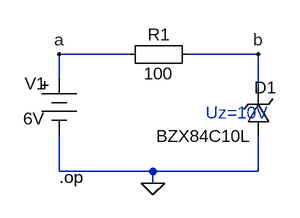
[diagram p0: schematic zener_current_1.asc]
zener_current_1.asc, the LTspice schematic file:
Version 4
SHEET 1 880 680
WIRE 112 -256 16 -256
WIRE 288 -256 192 -256
WIRE 16 -224 16 -256
WIRE 288 -208 288 -256
WIRE 16 -96 16 -144
WIRE 144 -96 16 -96
WIRE 288 -96 288 -144
WIRE 288 -96 144 -96
WIRE 144 -80 144 -96
FLAG 144 -80 0
FLAG 288 -256 b
FLAG 16 -256 a
SYMBOL Misc\\battery 16 -240 R0
WINDOW 123 0 0 Left 2
WINDOW 39 0 0 Left 2
WINDOW 0 -47 24 Left 2
WINDOW 3 -49 72 Left 2
SYMATTR InstName V1
SYMATTR Value 6V
SYMBOL Misc\\EuropeanResistor 208 -272 R90
WINDOW 0 5 56 VBottom 2
WINDOW 3 27 56 VTop 2
SYMATTR InstName R1
SYMATTR Value 100
SYMBOL zener 304 -144 R180
WINDOW 0 -9 66 Left 2
WINDOW 3 24 0 Left 2
SYMATTR InstName D1
SYMATTR Value BZX84C10L
TEXT 16 -88 Left 2 !.op
TEXT 216 -176 Left 2 ;Uz=10V

The netlist it stands for:
* zener_current_1.asc
V1 a 0 6V
R1 b a 100
D1 0 b BZX84C10L
.model D D
.lib standard.dio
.op
* Uz=10V
.backanno
.end